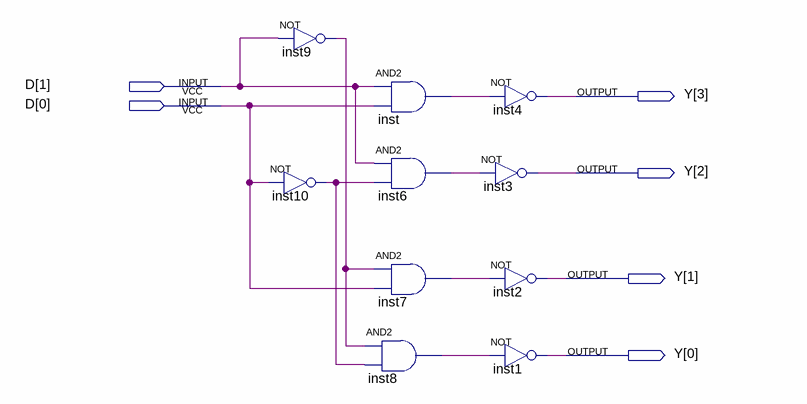
[diagram p0: schematic sheet]
// Quartus schematic decode2_4.bdf as structural Verilog: 10 symbols, 6 pins
module decode2_4 (
  input  [1:0] D,
  output [3:0] Y
);

  wire inst6_out, inst7_out, inst8_out, inst9_out, inst10_out, inst_out;

  not inst10 (inst10_out, D[0]);
  not inst9 (inst9_out, D[1]);
  and inst (inst_out, D[1], D[0]);
  and inst6 (inst6_out, D[1], inst10_out);
  and inst7 (inst7_out, inst9_out, D[0]);
  and inst8 (inst8_out, inst9_out, inst10_out);
  not inst4 (Y[3], inst_out);
  not inst3 (Y[2], inst6_out);
  not inst2 (Y[1], inst7_out);
  not inst1 (Y[0], inst8_out);
endmodule
